# EAGLE schematic Payload-Interposer (EAGLE 9.5.2)
DESIGNER: Vaibhav D. Nandha; PART_NUMBER: 68-0008; PROJECT: CougSat-1: Interposer; REV: 1.0.0

## Sheet 1 of 6
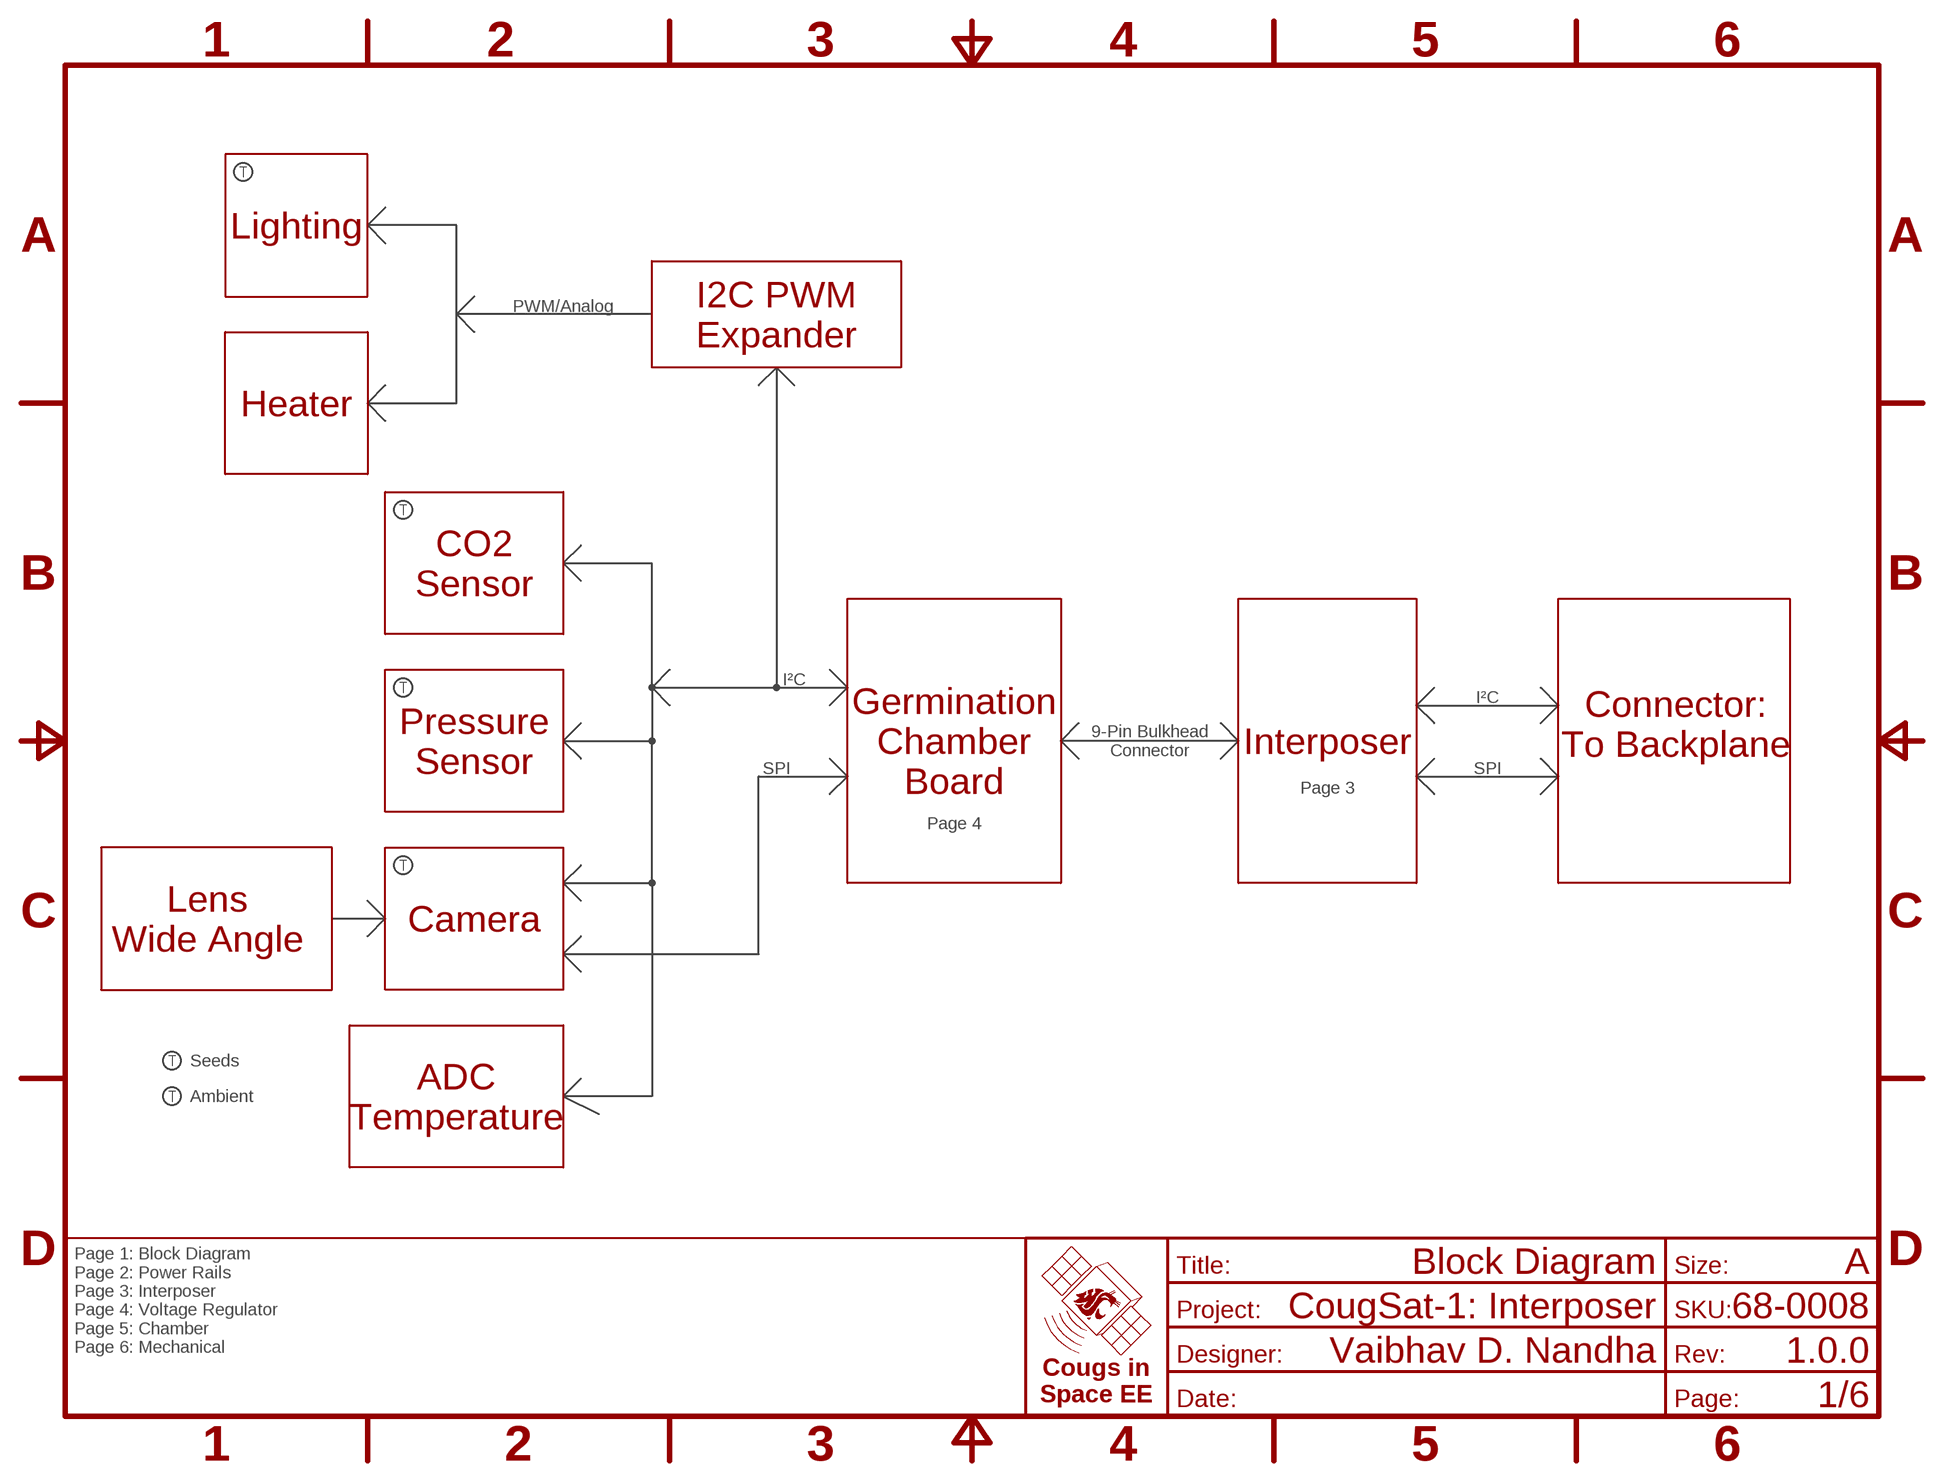
[diagram p0: schematic, sheet 1]
FRAME1 (FRAME-A): TITLE: Block Diagram

### Notes on the sheet
- Lighting
- PWM/Analog
- I2C PWM
  Expander
- Heater
- CO2
  Sensor
- I²C
- I²C
- Connector:
  To Backplane
- Pressure
  Sensor
- Germination
  Chamber
  Board
- 9-Pin Bulkhead
  Connector
- Interposer
- SPI | SPI
- Page 3
- Page 4
- Lens
  Wide Angle
- Camera
- Seeds
- Ambient
- ADC
  Temperature
- Page 1: Block Diagram
  Page 2: Power Rails
  Page 3: Interposer 
  Page 4: Voltage Regulator
  Page 5: Chamber
  Page 6: Mechanical

## Sheet 2 of 6
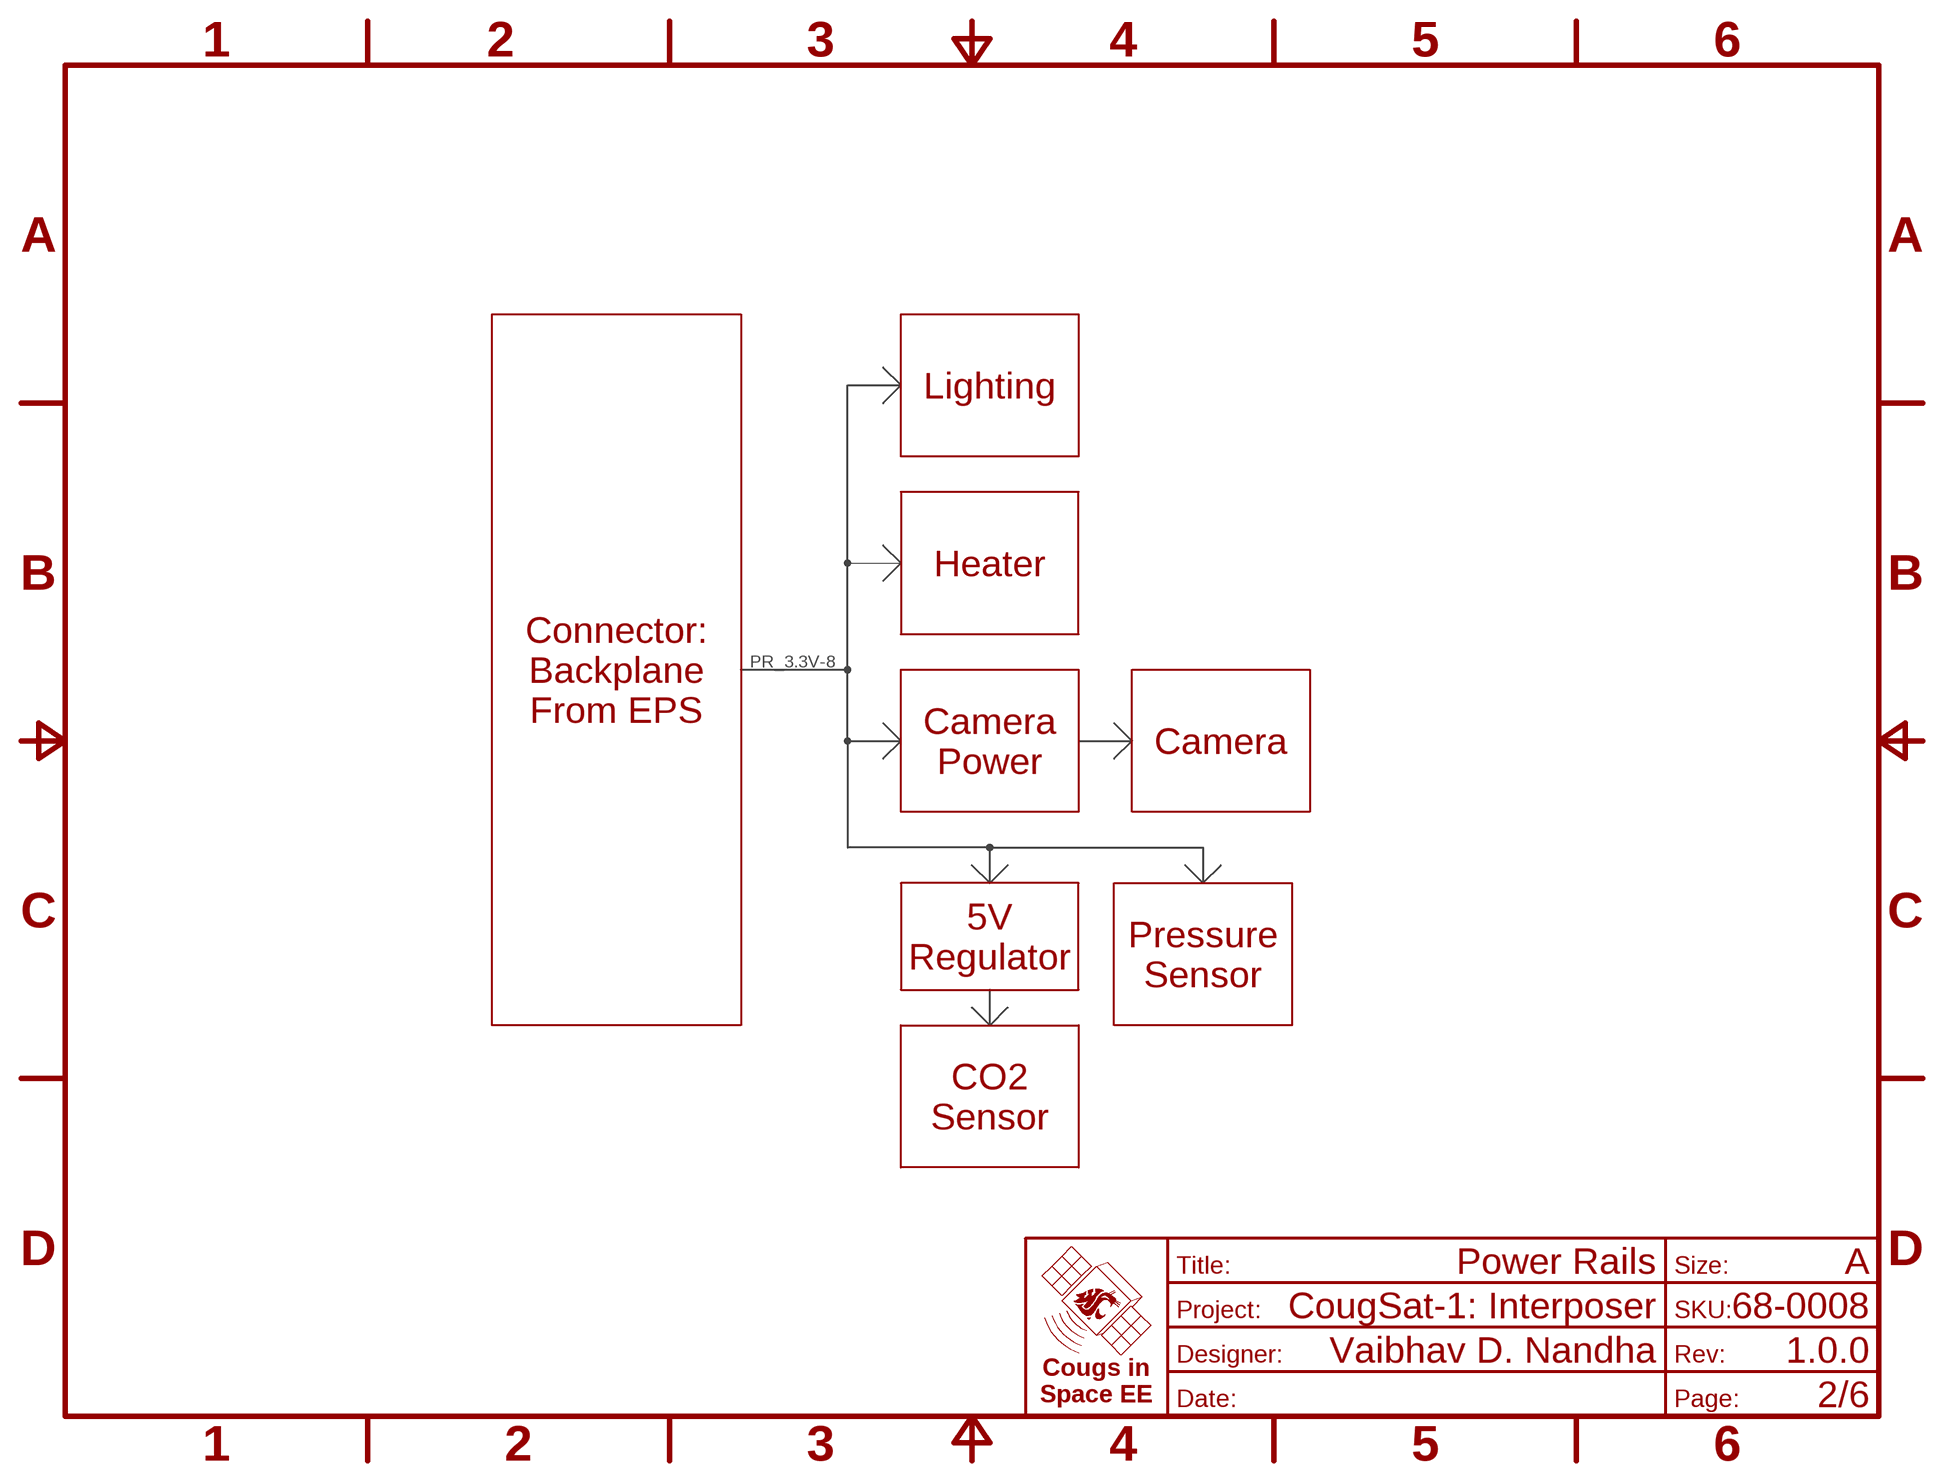
[diagram p1: schematic, sheet 2]
FRAME2 (FRAME-A): TITLE: Power Rails

### Notes on the sheet
- Lighting
- Heater
- PR_3.3V-8
- Connector:
  Backplane
  From EPS
- Camera
  Power
- Camera
- 5V
  Regulator
- Pressure
  Sensor
- CO2
  Sensor

## Sheet 3 of 6
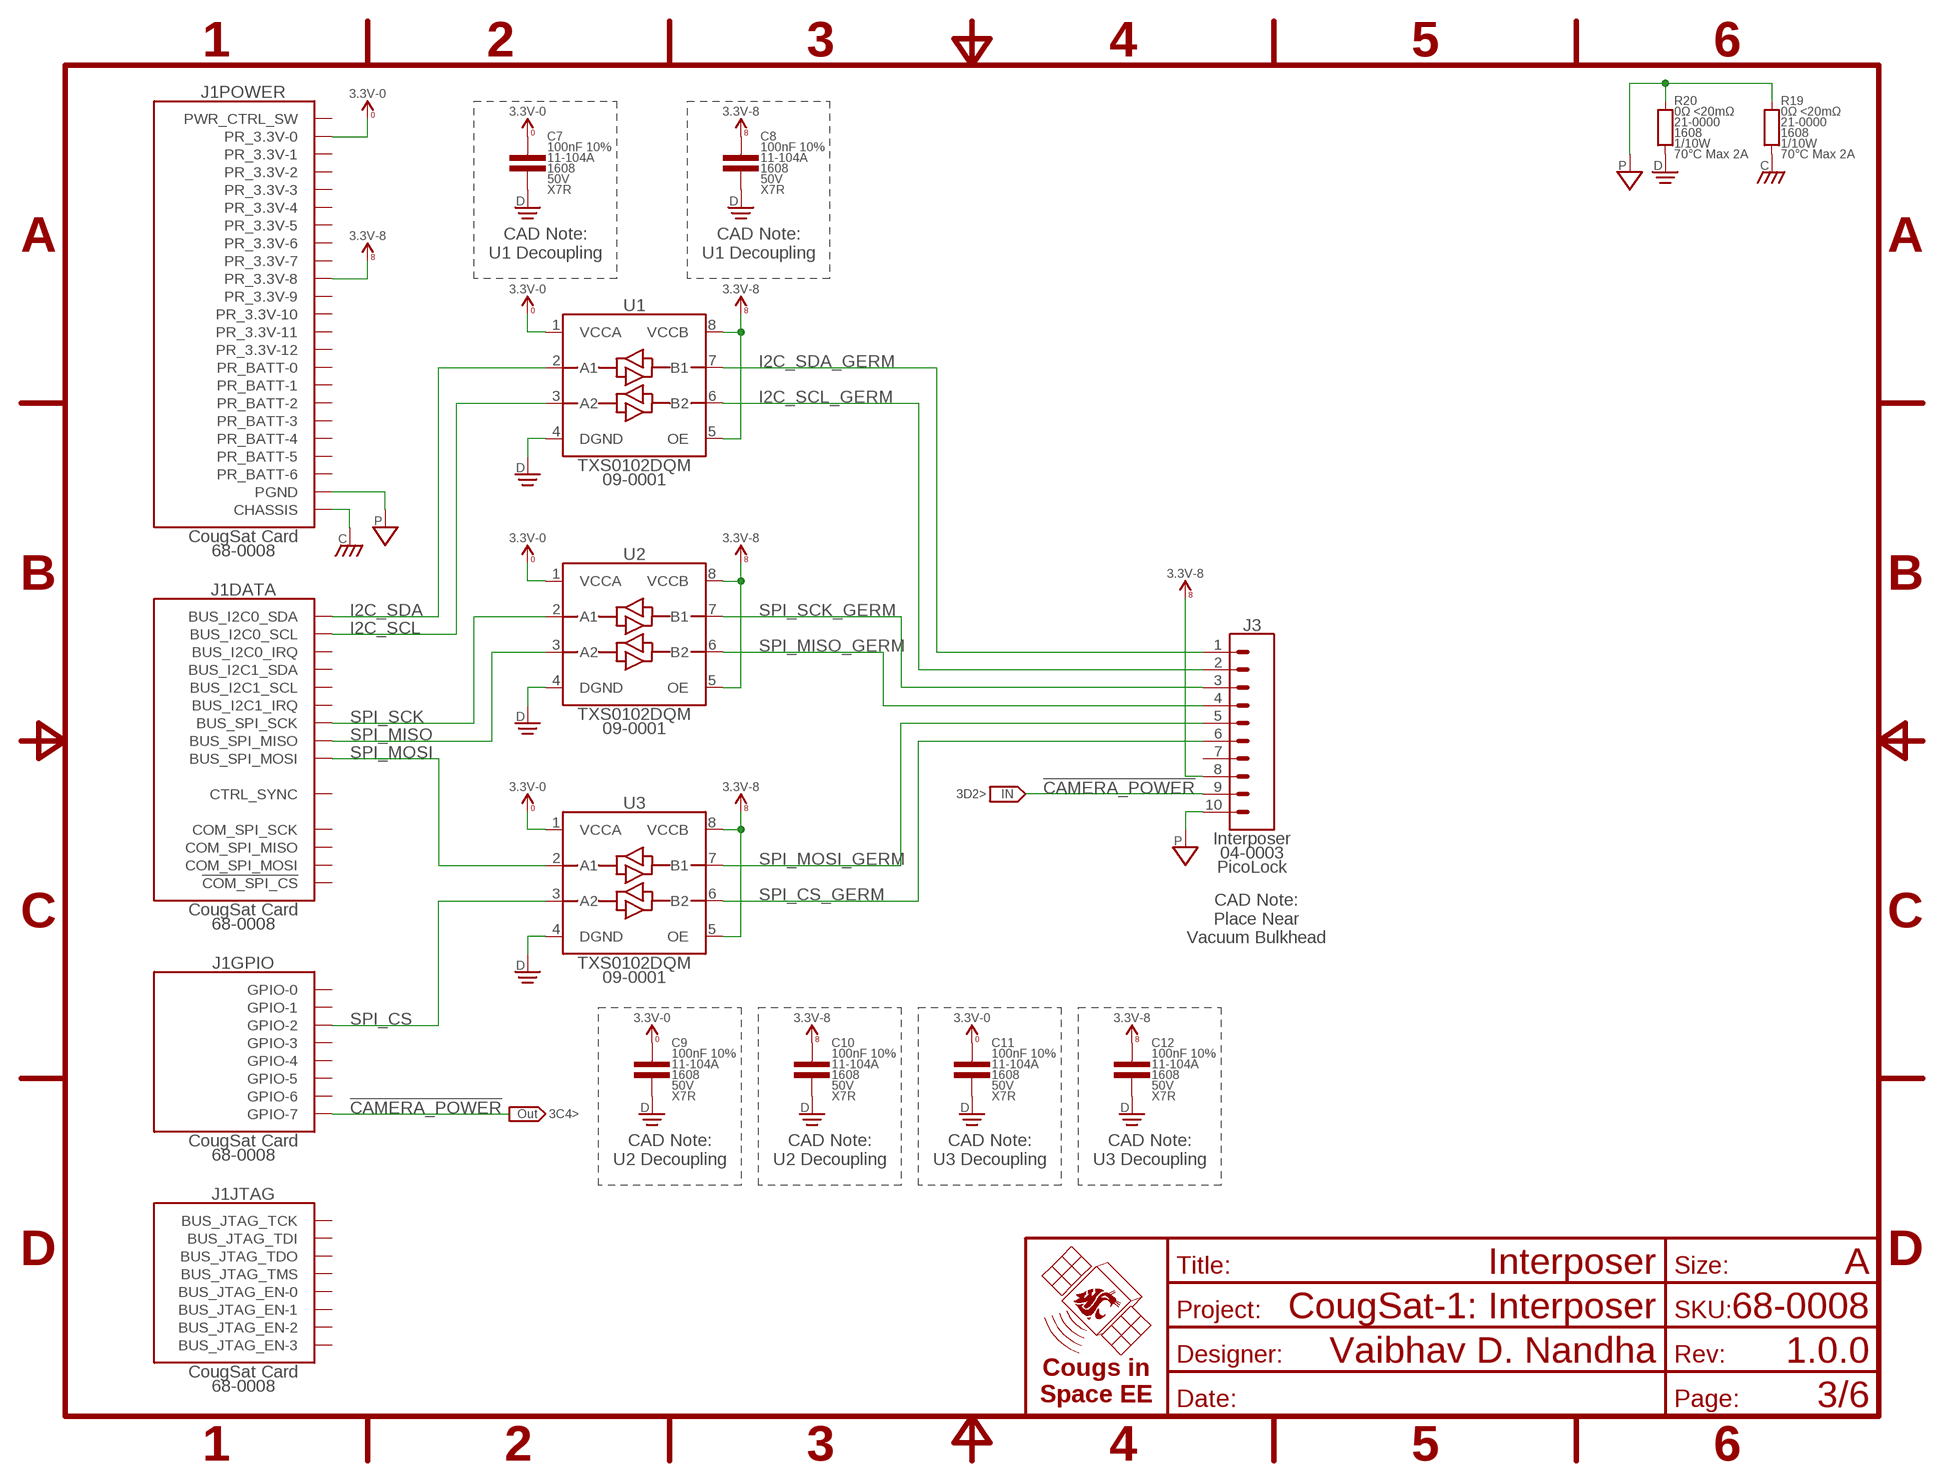
[diagram p2: schematic, sheet 3]
FRAME3 (FRAME-A): TITLE: Interposer

### Parts
C7  100nF 10%  CAP-V-100NF-1608  [1608]
C8  100nF 10%  CAP-V-100NF-1608  [1608]
C9  100nF 10%  CAP-V-100NF-1608  [1608]
C10  100nF 10%  CAP-V-100NF-1608  [1608]
C11  100nF 10%  CAP-V-100NF-1608  [1608]
C12  100nF 10%  CAP-V-100NF-1608  [1608]
J1  CougSat Card  CIS_CARD-OPEN+X  [CARD-FULL-OPEN+X]
J3  Interposer  1X10-PICOLOCK  [PICOLOCK1.5-10]
R19  0Ω <20mΩ  RES-V-0-1608  [1608]
R20  0Ω <20mΩ  RES-V-0-1608  [1608]
U1  TXS0102DQM  LEVEL_SHIFTER-2BIT-XSON-8  [X2SON-8]
U2  TXS0102DQM  LEVEL_SHIFTER-2BIT-XSON-8  [X2SON-8]
U3  TXS0102DQM  LEVEL_SHIFTER-2BIT-XSON-8  [X2SON-8]

### Nets
3.3V_0: C7.1 C9.1 C11.1 J1.A1(POWER:PR_3.3V-0) J1.B1(POWER:PR_3.3V-0) U1.1(VCCA) U2.1(VCCA) U3.1(VCCA) ; supply symbol labelled 3.3V-0
3.3V_8: C8.1 C10.1 C12.1 J1.A9(POWER:PR_3.3V-8) J1.B9(POWER:PR_3.3V-8) J3.8 U1.5(OE) U1.8(VCCB) U2.5(OE) U2.8(VCCB) U3.5(OE) U3.8(VCCB) ; supply symbol labelled 3.3V-8 ; also sheet 4,5
!CAMERA_POWER: J1.B41(GPIO:GPIO-7) J3.9 ; also sheet 5
CHASSIS: J1.CHASSIS@1(POWER:CHASSIS) J1.CHASSIS@2(POWER:CHASSIS) J1.CHASSIS@3(POWER:CHASSIS) J1.CHASSIS@4(POWER:CHASSIS) R19.1 ; also sheet 5
DGND: C7.2 C8.2 C9.2 C10.2 C11.2 C12.2 R20.1 U1.4(DGND) U2.4(DGND) U3.4(DGND) ; also sheet 5
I2C_SCL: J1.A44(DATA:BUS_I2C0_SCL) J1.B44(DATA:BUS_I2C0_SCL) U1.3(A2)
I2C_SCL_GERM: J3.2 U1.6(B2) ; also sheet 5
I2C_SDA: J1.A43(DATA:BUS_I2C0_SDA) J1.B43(DATA:BUS_I2C0_SDA) U1.2(A1)
I2C_SDA_GERM: J3.1 U1.7(B1) ; also sheet 5
PGND: J1.A21(POWER:PGND) J1.A22(POWER:PGND) J1.A23(POWER:PGND) J1.B21(POWER:PGND) J1.B22(POWER:PGND) J1.B23(POWER:PGND) J1.B24(POWER:PGND) J1.B25(POWER:PGND) J1.B26(POWER:PGND) J1.B27(POWER:PGND) J1.B28(POWER:PGND) J1.B29(POWER:PGND) J3.10 R19.2 R20.2 ; also sheet 4,5
SPI_CS: J1.A26(GPIO:GPIO-2) U3.3(A2)
SPI_CS_GERM: J3.6 U3.6(B2) ; also sheet 5
SPI_MISO: J1.A38(DATA:BUS_SPI_MISO) J1.B38(DATA:BUS_SPI_MISO) U2.3(A2)
SPI_MISO_GERM: J3.4 U2.6(B2) ; also sheet 5
SPI_MOSI: J1.A39(DATA:BUS_SPI_MOSI) J1.B39(DATA:BUS_SPI_MOSI) U3.2(A1)
SPI_MOSI_GERM: J3.5 U3.7(B1) ; also sheet 5
SPI_SCK: J1.A37(DATA:BUS_SPI_SCK) J1.B37(DATA:BUS_SPI_SCK) U2.2(A1)
SPI_SCK_GERM: J3.3 U2.7(B1) ; also sheet 5
Unconnected: J1.A24(GPIO:GPIO-0) J1.A25(GPIO:GPIO-1) J1.A27(GPIO:GPIO-3) J1.A28(GPIO:GPIO-4) J1.A29(GPIO:GPIO-5) J1.A30(DATA:BUS_I2C1_SDA) J1.A31(DATA:BUS_I2C1_SCL) J1.A32(DATA:BUS_I2C1_IRQ) J1.A33(DATA:COM_SPI_SCK) J1.A34(DATA:COM_SPI_MISO) J1.A35(DATA:COM_SPI_MOSI) J1.A36(DATA:!COM_SPI_CS) J1.A40(POWER:PWR_CTRL_SW) J1.A41(GPIO:GPIO-6) J1.A42(DATA:CTRL_SYNC) J1.A45(DATA:BUS_I2C0_IRQ) J1.A46(JTAG:BUS_JTAG_TCK) J1.A47(JTAG:BUS_JTAG_TDI) J1.A48(JTAG:BUS_JTAG_TDO) J1.A49(JTAG:BUS_JTAG_TMS) J1.B30(DATA:BUS_I2C1_SDA) J1.B31(DATA:BUS_I2C1_SCL) J1.B32(DATA:BUS_I2C1_IRQ) J1.B33(DATA:COM_SPI_SCK) J1.B34(DATA:COM_SPI_MISO) J1.B35(DATA:COM_SPI_MOSI) J1.B36(DATA:!COM_SPI_CS) J1.B40(POWER:PWR_CTRL_SW) J1.B42(DATA:CTRL_SYNC) J1.B45(DATA:BUS_I2C0_IRQ) J1.B46(JTAG:BUS_JTAG_EN-0) J1.B47(JTAG:BUS_JTAG_EN-1) J1.B48(JTAG:BUS_JTAG_EN-2) J1.B49(JTAG:BUS_JTAG_EN-3) J3.7

### Notes on the sheet
- CAD Note:
  U1 Decoupling
- CAD Note:
  U1 Decoupling
- 3D2>
- CAD Note:
  Place Near
  Vacuum Bulkhead
- 3C4>
- CAD Note:
  U2 Decoupling
- CAD Note:
  U2 Decoupling
- CAD Note:
  U3 Decoupling
- CAD Note:
  U3 Decoupling

## Sheet 4 of 6
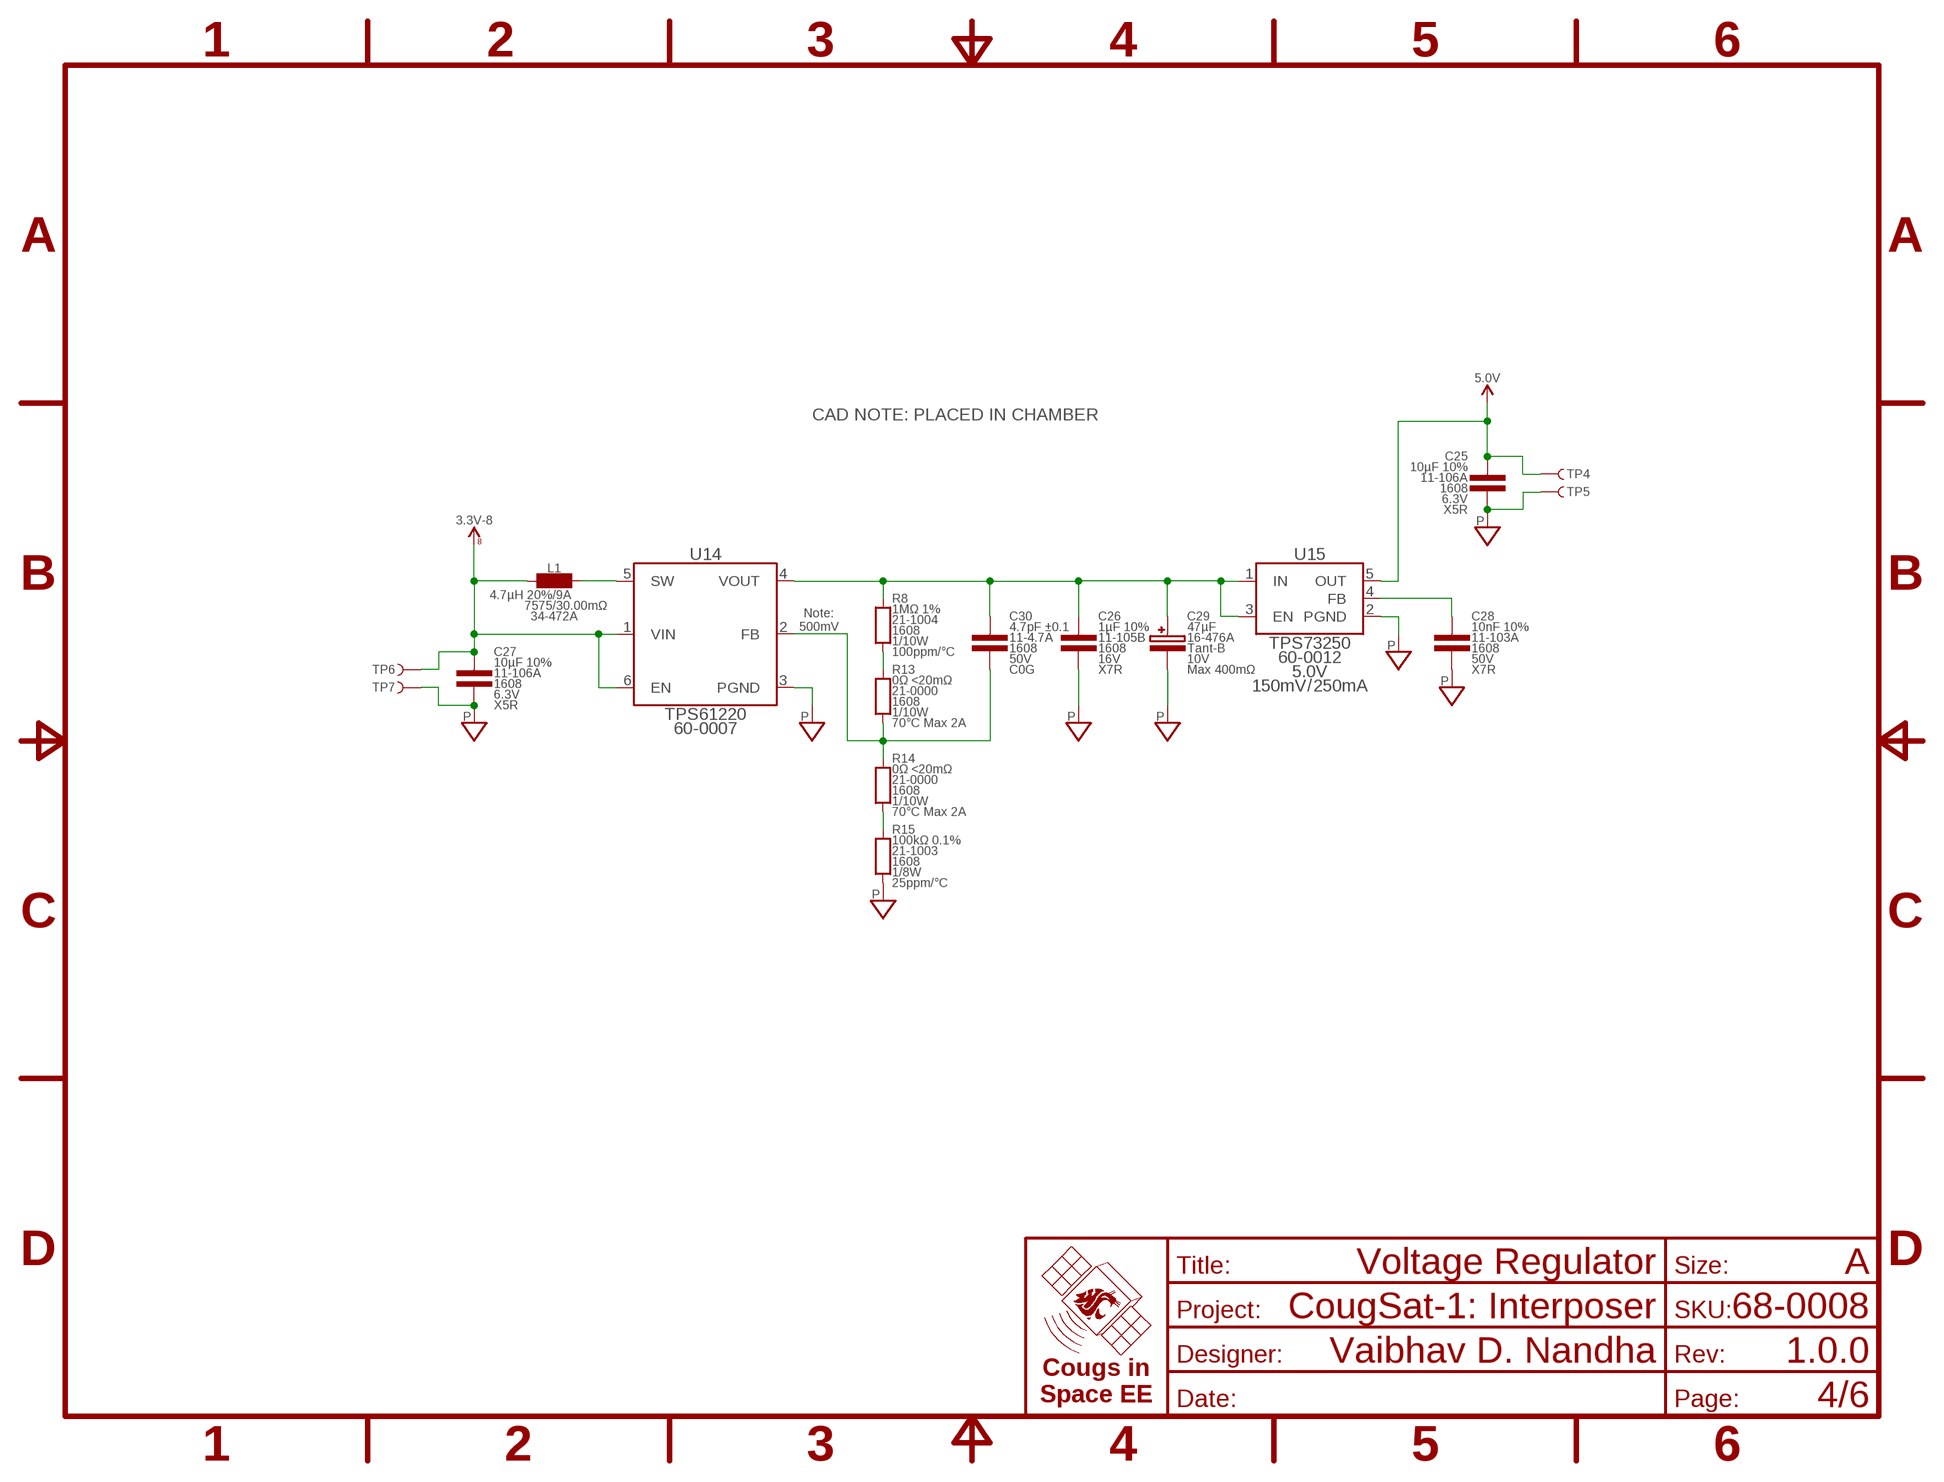
[diagram p3: schematic, sheet 4]
FRAME6 (FRAME-A): TITLE: Voltage Regulator

### Parts
C25  10µF 10%  CAP-V-10UF-1608  [1608]
C26  1µF 10%  CAP-V-1UF-B-1608  [1608]
C27  10µF 10%  CAP-V-10UF-1608  [1608]
C28  10nF 10%  CAP-V-10NF-1608  [1608]
C29  47µF  CAP-POL-V-47UF-4028  [4028-POL]
C30  4.7pF ±0.1  CAP-V-4.7PF-1608  [1608]
L1  4.7µH 20%  INDUCTOR-H-4.7UH-7575  [7575]
R8  1MΩ 1%  RES-V-1M-1608  [1608]
R13  0Ω <20mΩ  RES-V-0-1608  [1608]
R14  0Ω <20mΩ  RES-V-0-1608  [1608]
R15  100kΩ 0.1%  RES-V-100K-1608  [1608]
TP4  TEST_POINT-THT-1.0  [THT-1.0]
TP5  TEST_POINT-THT-1.0  [THT-1.0]
TP6  TEST_POINT-THT-1.0  [THT-1.0]
TP7  TEST_POINT-THT-1.0  [THT-1.0]
U14  TPS61220  [SOT363]
U15  TPS73250  LDO-FB-5.0-SOT23-5  [SOT23-5]

### Nets
3.3V_8: C27.1 L1.1 TP6.1 U14.1(VIN) U14.6(EN) ; supply symbol labelled 3.3V-8 ; also sheet 3,5
5.0V: C25.1 TP4.1 U15.5(OUT) ; also sheet 5
BOOST_FB: C30.2 R13.1 R14.2 U14.2(FB)
BOOST_FB-HIGH: R8.1 R13.2
BOOST_FB-LOW: R14.1 R15.2
BOOST_IN: L1.2 U14.5(SW)
BOOST_OUT: C26.1 C29.A C30.1 R8.2 U14.4(VOUT) U15.1(IN) U15.3(EN)
PGND: C25.2 C26.2 C27.2 C28.2 C29.C R15.1 TP5.1 TP7.1 U14.3(PGND) U15.2(PGND) ; also sheet 3,5
REG_FB: C28.1 U15.4(FB)

### Notes on the sheet
- CAD NOTE: PLACED IN CHAMBER
- Note:
  500mV

## Sheet 5 of 6
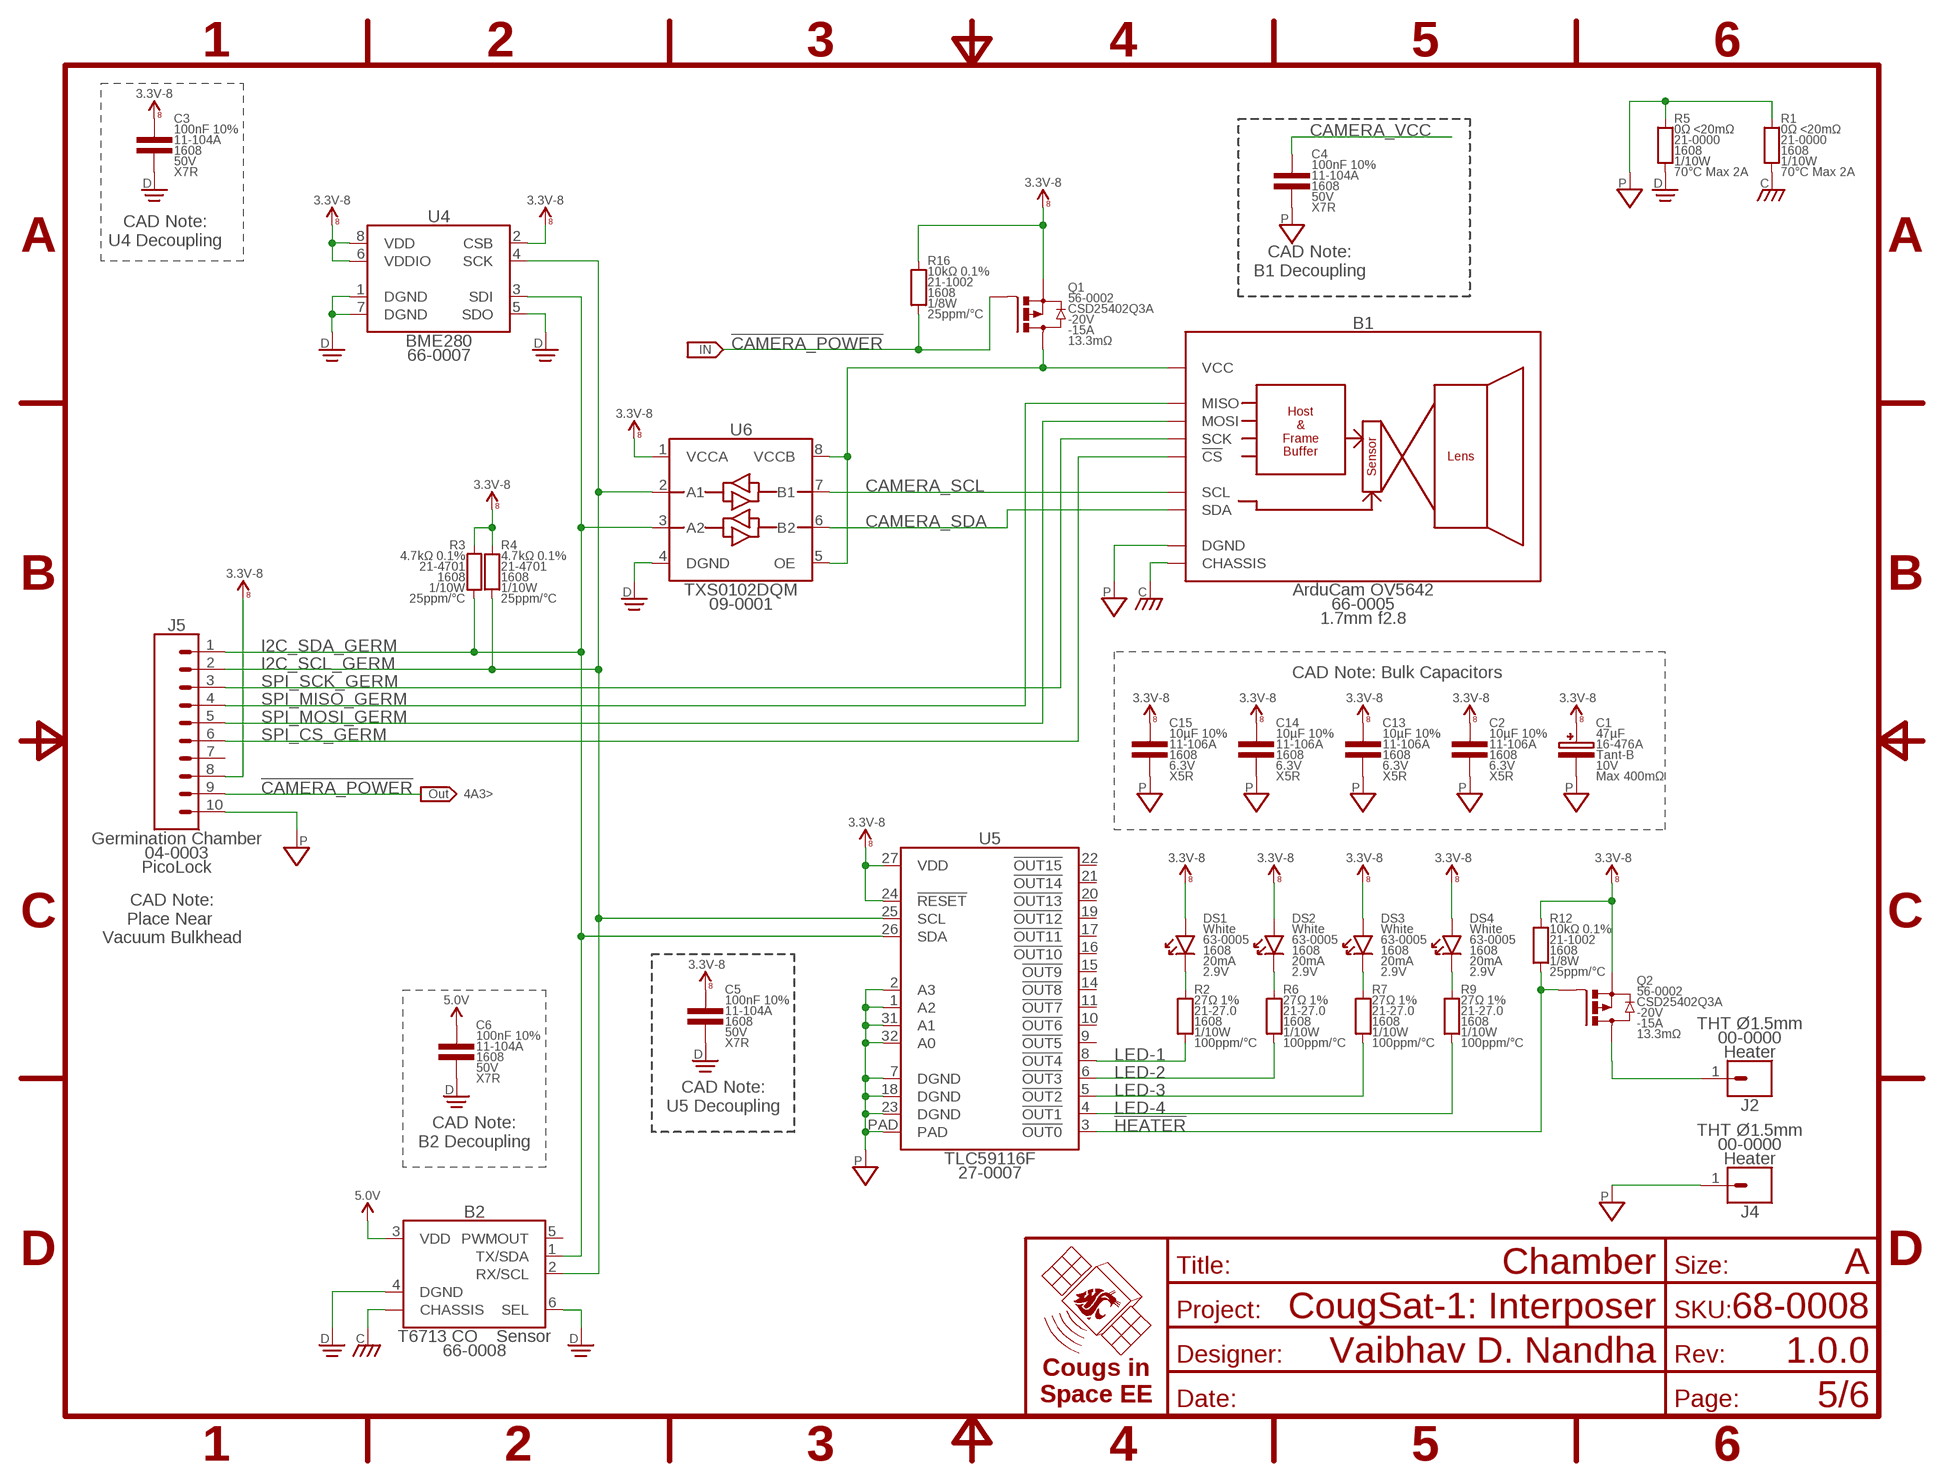
[diagram p4: schematic, sheet 5]
FRAME5 (FRAME-A): TITLE: Chamber

### Parts
B1  ArduCam OV5642  ARDUCAM-5MP-1.7MM-F2.8  [ARDUCAM]
B2  T6713 CO₂ Sensor  T6713  [T6713]
C1  47µF  CAP-POL-V-47UF-4028  [4028-POL]
C2  10µF 10%  CAP-V-10UF-1608  [1608]
C3  100nF 10%  CAP-V-100NF-1608  [1608]
C4  100nF 10%  CAP-V-100NF-1608  [1608]
C5  100nF 10%  CAP-V-100NF-1608  [1608]
C6  100nF 10%  CAP-V-100NF-1608  [1608]
C13  10µF 10%  CAP-V-10UF-1608  [1608]
C14  10µF 10%  CAP-V-10UF-1608  [1608]
C15  10µF 10%  CAP-V-10UF-1608  [1608]
DS1  White  LED-V-WHT-1608  [1608-POL]
DS2  White  LED-V-WHT-1608  [1608-POL]
DS3  White  LED-V-WHT-1608  [1608-POL]
DS4  White  LED-V-WHT-1608  [1608-POL]
J2  Heater  1X01-THT-1.5  [THT-1.5]
J4  Heater  1X01-THT-1.5  [THT-1.5]
J5  Germination Chamber  1X10-PICOLOCK  [PICOLOCK1.5-10]
Q1  CSD25402Q3A  MOSFET-P-SON-3333  [SON-3333]
Q2  CSD25402Q3A  MOSFET-P-SON-3333  [SON-3333]
R1  0Ω <20mΩ  RES-V-0-1608  [1608]
R2  27Ω 1%  RES-V-27R-1608  [1608]
R3  4.7kΩ 0.1%  RES-V-4.7K-1608  [1608]
R4  4.7kΩ 0.1%  RES-V-4.7K-1608  [1608]
R5  0Ω <20mΩ  RES-V-0-1608  [1608]
R6  27Ω 1%  RES-V-27R-1608  [1608]
R7  27Ω 1%  RES-V-27R-1608  [1608]
R9  27Ω 1%  RES-V-27R-1608  [1608]
R12  10kΩ 0.1%  RES-V-10K-1608  [1608]
R16  10kΩ 0.1%  RES-V-10K-1608  [1608]
U4  BME280  [BME280]
U5  TLC59116F  [QFN-32-5050]
U6  TXS0102DQM  LEVEL_SHIFTER-2BIT-XSON-8  [X2SON-8]

### Nets
3.3V_8: C1.A C2.1 C3.1 C5.1 C13.1 C14.1 C15.1 DS1.A DS2.A DS3.A DS4.A J5.8 Q1.5(S) Q1.6(S) Q1.7(S) Q1.8(S) Q1.PAD(S) Q2.5(S) Q2.6(S) Q2.7(S) Q2.8(S) Q2.PAD(S) R3.2 R4.2 R12.2 R16.2 U4.2(CSB) U4.6(VDDIO) U4.8(VDD) U5.24(!RESET) U5.27(VDD) U6.1(VCCA) ; supply symbol labelled 3.3V-8 ; also sheet 3,4
5.0V: B2.3(VDD) C6.1 ; also sheet 4
!CAMERA_POWER: J5.9 Q1.4(G) R16.1 ; also sheet 3
!HEATER: Q2.4(G) R12.1 U5.3(!OUT0)
CAMERA_SCL: B1.8(SCL) U6.7(B1)
CAMERA_SDA: B1.7(SDA) U6.6(B2)
CAMERA_VCC: B1.6(VCC) C4.1 Q1.1(D) Q1.2(D) Q1.3(D) U6.5(OE) U6.8(VCCB)
CHASSIS: B1.CHASSIS@1(CHASSIS) B1.CHASSIS@2(CHASSIS) B1.CHASSIS@3(CHASSIS) B1.CHASSIS@4(CHASSIS) B1.CHASSIS@5(CHASSIS) B1.CHASSIS@6(CHASSIS) B1.CHASSIS@7(CHASSIS) B1.CHASSIS@8(CHASSIS) B1.CHASSIS@9(CHASSIS) B1.CHASSIS@10(CHASSIS) B1.CHASSIS@11(CHASSIS) B1.CHASSIS@12(CHASSIS) B1.CHASSIS@13(CHASSIS) B1.CHASSIS@14(CHASSIS) B1.CHASSIS@15(CHASSIS) B1.CHASSIS@16(CHASSIS) B1.CHASSIS@17(CHASSIS) B1.CHASSIS@18(CHASSIS) B2.CHASSIS@1(CHASSIS) B2.CHASSIS@2(CHASSIS) R1.1 ; also sheet 3
DGND: B2.4(DGND) B2.6(SEL) C3.2 C5.2 C6.2 R5.1 U4.1(DGND) U4.5(SDO) U4.7(DGND) U6.4(DGND) ; also sheet 3
HEATER_SOURCE: J2.1 Q2.1(D) Q2.2(D) Q2.3(D)
I2C_SCL_GERM: B2.2(RX/SCL) J5.2 R4.1 U4.4(SCK) U5.25(SCL) U6.2(A1) ; also sheet 3
I2C_SDA_GERM: B2.1(TX/SDA) J5.1 R3.1 U4.3(SDI) U5.26(SDA) U6.3(A2) ; also sheet 3
LED-1: R2.1 U5.8(!OUT4)
LED-2: R6.1 U5.6(!OUT3)
LED-3: R7.1 U5.5(!OUT2)
LED-4: R9.1 U5.4(!OUT1)
LED_1_INT: DS1.C R2.2
LED_2_INT: DS2.C R6.2
LED_3_INT: DS3.C R7.2
LED_4_INT: DS4.C R9.2
PGND: B1.5(DGND) C1.C C2.2 C4.2 C13.2 C14.2 C15.2 J4.1 J5.10 R1.2 R5.2 U5.1(A2) U5.2(A3) U5.7(DGND) U5.18(DGND) U5.23(DGND) U5.31(A1) U5.32(A0) U5.PAD ; also sheet 3,4
SPI_CS_GERM: B1.1(!CS) J5.6 ; also sheet 3
SPI_MISO_GERM: B1.3(MISO) J5.4 ; also sheet 3
SPI_MOSI_GERM: B1.2(MOSI) J5.5 ; also sheet 3
SPI_SCK_GERM: B1.4(SCK) J5.3 ; also sheet 3
Unconnected: B2.5(PWMOUT) J5.7 U5.9(!OUT5) U5.10(!OUT6) U5.11(!OUT7) U5.14(!OUT8) U5.15(!OUT9) U5.16(!OUT10) U5.17(!OUT11) U5.19(!OUT12) U5.20(!OUT13) U5.21(!OUT14) U5.22(!OUT15)

### Notes on the sheet
- CAD Note:
  U4 Decoupling
- CAD Note:
  B1 Decoupling
- CAD Note: Bulk Capacitors
- 4A3>
- CAD Note:
  Place Near 
  Vacuum Bulkhead
- CAD Note:
  U5 Decoupling
- CAD Note:
  B2 Decoupling

## Sheet 6 of 6
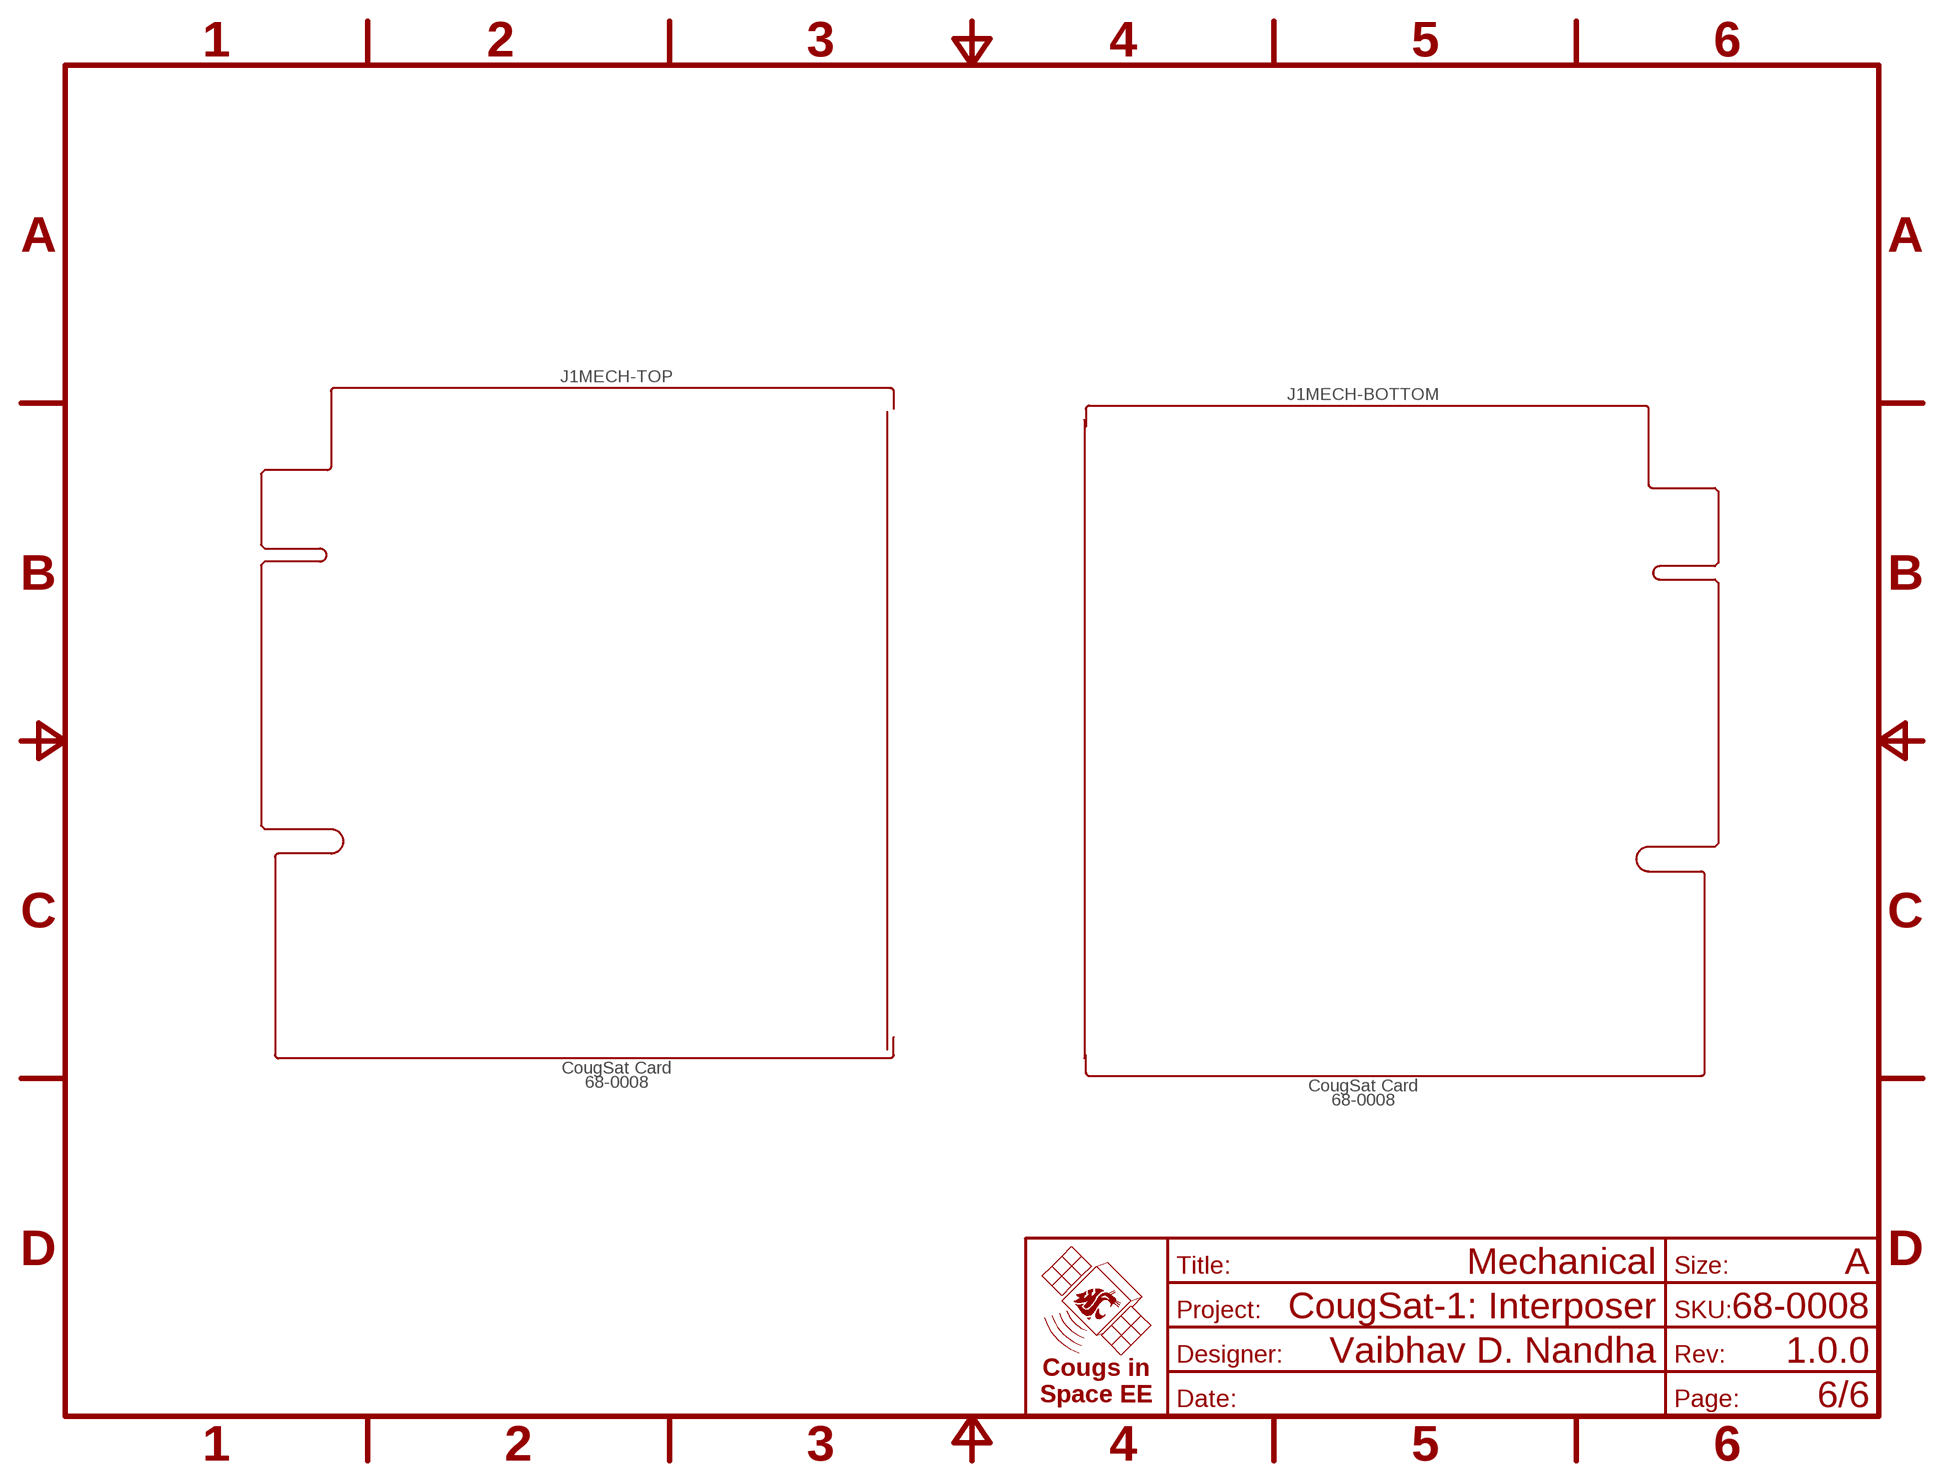
[diagram p5: schematic, sheet 6]
FRAME4 (FRAME-A): TITLE: Mechanical

## Power pins joined to a net without a drawn wire
PR_3.3V-1: J1.A2(POWER:PR_3.3V-1) J1.B2(POWER:PR_3.3V-1)
PR_3.3V-2: J1.A3(POWER:PR_3.3V-2) J1.B3(POWER:PR_3.3V-2)
PR_3.3V-3: J1.A4(POWER:PR_3.3V-3) J1.B4(POWER:PR_3.3V-3)
PR_3.3V-4: J1.A5(POWER:PR_3.3V-4) J1.B5(POWER:PR_3.3V-4)
PR_3.3V-5: J1.A6(POWER:PR_3.3V-5) J1.B6(POWER:PR_3.3V-5)
PR_3.3V-6: J1.A7(POWER:PR_3.3V-6) J1.B7(POWER:PR_3.3V-6)
PR_3.3V-7: J1.A8(POWER:PR_3.3V-7) J1.B8(POWER:PR_3.3V-7)
PR_3.3V-9: J1.A10(POWER:PR_3.3V-9) J1.B10(POWER:PR_3.3V-9)
PR_3.3V-10: J1.A11(POWER:PR_3.3V-10) J1.B11(POWER:PR_3.3V-10)
PR_3.3V-11: J1.A12(POWER:PR_3.3V-11) J1.B12(POWER:PR_3.3V-11)
PR_3.3V-12: J1.A13(POWER:PR_3.3V-12) J1.B13(POWER:PR_3.3V-12)
PR_BATT-0: J1.A14(POWER:PR_BATT-0) J1.B14(POWER:PR_BATT-0)
PR_BATT-1: J1.A15(POWER:PR_BATT-1) J1.B15(POWER:PR_BATT-1)
PR_BATT-2: J1.A16(POWER:PR_BATT-2) J1.B16(POWER:PR_BATT-2)
PR_BATT-3: J1.A17(POWER:PR_BATT-3) J1.B17(POWER:PR_BATT-3)
PR_BATT-4: J1.A18(POWER:PR_BATT-4) J1.B18(POWER:PR_BATT-4)
PR_BATT-5: J1.A19(POWER:PR_BATT-5) J1.B19(POWER:PR_BATT-5)
PR_BATT-6: J1.A20(POWER:PR_BATT-6) J1.B20(POWER:PR_BATT-6)

## Library data of the parts
B1 = CougsInSpace-Sensors:ARDUCAM: ArduCam Module; LENS: 1.7mm f2.8; SKU: 66-0005
B2 = CougsInSpace-Sensors:T6713: T6713 CO₂ Sensor; SKU: 66-0008
C1 C29 = CougsInSpace-Capacitors:CAP-POL-V: Capacitor Polarized - Vertical Orientation; ESR: Max 400mΩ; PACKAGE: Tant-B; SKU: 16-476A; VOLTAGE: 10V
C2 C13-C15 C25 C27 = CougsInSpace-Capacitors:CAP-V: Capacitor - Vertical Orientation; PACKAGE: 1608; SKU: 11-106A; TEMP: X5R; VOLTAGE: 6.3V
C3-C12 = CougsInSpace-Capacitors:CAP-V: Capacitor - Vertical Orientation; PACKAGE: 1608; SKU: 11-104A; TEMP: X7R; VOLTAGE: 50V
C26 = CougsInSpace-Capacitors:CAP-V: Capacitor - Vertical Orientation; PACKAGE: 1608; SKU: 11-105B; TEMP: X7R; VOLTAGE: 16V
C28 = CougsInSpace-Capacitors:CAP-V: Capacitor - Vertical Orientation; PACKAGE: 1608; SKU: 11-103A; TEMP: X7R; VOLTAGE: 50V
C30 = CougsInSpace-Capacitors:CAP-V: Capacitor - Vertical Orientation; PACKAGE: 1608; SKU: 11-4.7A; TEMP: C0G; VOLTAGE: 50V
DS1-DS4 = CougsInSpace-LEDs:LED-V: LED Vertical; CURRENT: 20mA; PACKAGE: 1608; SKU: 63-0005; VF: 2.9V
J1 = CougsInSpace-Boards:CIS_CARD-OPEN+X: CougSat Card - Open +X; SKU: 68-0008
J2 J4 = CougsInSpace-Connectors:1X01: Generic Connector - 1 Conductor; PACKAGE: THT Ø1.5mm; SKU: 00-0000
J3 J5 = CougsInSpace-Connectors:1X10: Generic Connector - 10 Conductor; PACKAGE: PicoLock; SKU: 04-0003
L1 = CougsInSpace-Coils:INDUCTOR-H: Inductor Horizontal; CURRENT: 9A; DCR: 30.00mΩ; PACKAGE: 7575; SKU: 34-472A
Q1 Q2 = CougsInSpace-DiscreteSemi:MOSFET-P: P-Channel MOSFET; CURRENT: -15A; RDS: 13.3mΩ; SKU: 56-0002; VDS: -20V
R1 R5 R13 R14 R19 R20 = CougsInSpace-Resistors:RES-V: Resistor Vertical; PACKAGE: 1608; POWER: 1/10W; SKU: 21-0000; TEMP: 70°C Max 2A
R2 R6 R7 R9 = CougsInSpace-Resistors:RES-V: Resistor Vertical; PACKAGE: 1608; POWER: 1/10W; SKU: 21-27.0; TEMP: 100ppm/°C
R3 R4 = CougsInSpace-Resistors:RES-V: Resistor Vertical; PACKAGE: 1608; POWER: 1/10W; SKU: 21-4701; TEMP: 25ppm/°C
R8 = CougsInSpace-Resistors:RES-V: Resistor Vertical; PACKAGE: 1608; POWER: 1/10W; SKU: 21-1004; TEMP: 100ppm/°C
R12 R16 = CougsInSpace-Resistors:RES-V: Resistor Vertical; PACKAGE: 1608; POWER: 1/8W; SKU: 21-1002; TEMP: 25ppm/°C
R15 = CougsInSpace-Resistors:RES-V: Resistor Vertical; PACKAGE: 1608; POWER: 1/8W; SKU: 21-1003; TEMP: 25ppm/°C
TP4-TP7 = CougsInSpace-Connectors:TEST_POINT: Test Point Used to probe points in a circuit for debugging or general measurement
U1-U3 U6 = CougsInSpace-IC-Comms:LEVEL_SHIFTER-2BIT: Logic Level Shifter Bidirectional - 2b; SKU: 09-0001
U4 = CougsInSpace-Sensors:BME280: BME280 - Pressure, Temp, Humidity Sensor; SKU: 66-0007
U5 = CougsInSpace-IC-Conversion:TLC59116F: TLC59116F - I²C PWM Generator; SKU: 27-0007
U14 = CougsInSpace-IC-Power:TPS61220: DC/DC Converter Boost 200mA TPS61220 <https://github.com/CougsInSpace/Resources/blob/master/SupplierDocuments/Ti/TPS61220_BoostConverter.pdf>; SKU: 60-0007
U15 = CougsInSpace-IC-Power:LDO-FB: Low Dropout Linear Regulator - with Feedback; IMAX: 250mA; SKU: 60-0012; VDO: 150mV; VOUT: 5.0V